# EAGLE schematic BioPunk5 (EAGLE 6.3)
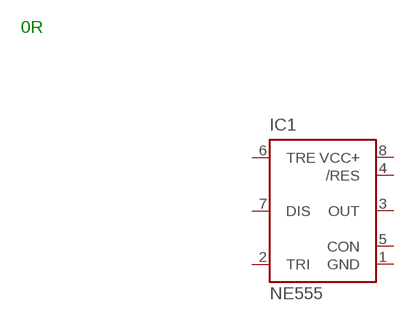
[diagram p0: schematic, sheet 1]

## Parts
IC1  NE555  [DIL-08]
Unconnected: IC1.2(TRI) IC1.3(OUT) IC1.4(/RES) IC1.5(CON) IC1.6(TRE) IC1.7(DIS)

## Notes on the sheet
- 0R

## Power pins joined to a net without a drawn wire
GND: IC1.1(GND)
VCC+: IC1.8(VCC+)

## Library data of the parts
IC1 = st-microelectronics:NE555: General purpose bipolar Timer; MF: Arrow Electronics; MPN: NE555N; OC_FARNELL: 1467742; OC_NEWARK: 89K1486